# Altium schematic sheet F_BRIDGE.SchDoc
size A4; SheetNumber: 5; SheetTotal: 13
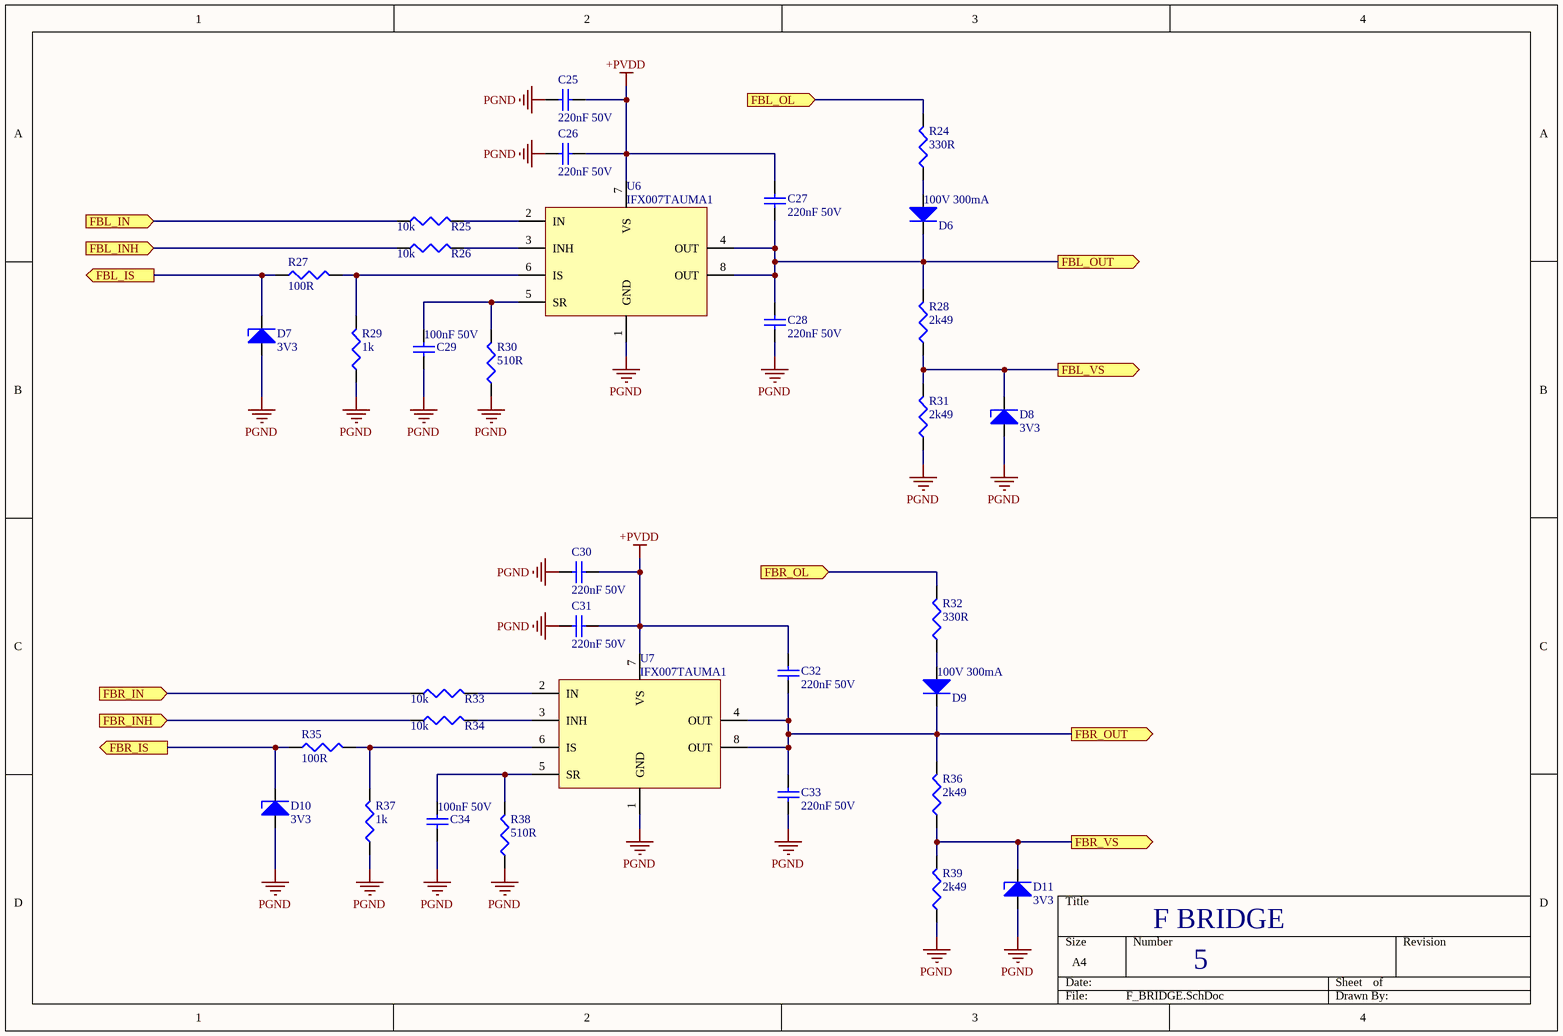
[diagram p0: F_BRIDGE.SchDoc]

## Parts
C25  220nF 50V  [CAP1206]
C26  220nF 50V  [CAP1206]
C27  220nF 50V  [CAP1206]
C28  220nF 50V  [CAP1206]
C29  100nF 50V  [CAP0603]
C30  220nF 50V  [CAP1206]
C31  220nF 50V  [CAP1206]
C32  220nF 50V  [CAP1206]
C33  220nF 50V  [CAP1206]
C34  100nF 50V  [CAP0603]
D6  100V 300mA  [SOD123_1N4148W-7-F]
D7  3V3  [SOD323]
D8  3V3  [SOD323]
D9  100V 300mA  [SOD123_1N4148W-7-F]
D10  3V3  [SOD323]
D11  3V3  [SOD323]
R24  330R  [RES0603]
R25  10k  [RES0603]
R26  10k  [RES0603]
R27  100R  [RES0603]
R28  2k49  [RES0603]
R29  1k  [RES0603]
R30  510R  [RES0603]
R31  2k49  [RES0603]
R32  330R  [RES0603]
R33  10k  [RES0603]
R34  10k  [RES0603]
R35  100R  [RES0603]
R36  2k49  [RES0603]
R37  1k  [RES0603]
R38  510R  [RES0603]
R39  2k49  [RES0603]
U6  P/N: IFX007TAUMA1  [TO-263-8]  (hidden comment: 55A)
U7  P/N: IFX007TAUMA1  [TO-263-8]  (hidden comment: 55A)

## Ports
FBL_IN (in), FBL_INH (in), FBL_IS (out), FBL_OL (in), FBL_OUT (out), FBL_VS (out), FBR_IN (in), FBR_INH (in), FBR_IS (out), FBR_OL (in), FBR_OUT (out), FBR_VS (out)

## Nets
+PVDD: C25.2 C26.2 C27.1 C30.2 C31.2 C32.1 U6.7(VS) U7.7(VS)
PGND: C25.1 C26.1 C28.2 C29.1 C30.1 C31.1 C33.2 C34.1 D7.2(A) D8.2(A) D10.2(A) D11.2(A) R29.1 R30.1 R31.1 R37.1 R38.1 R39.1 U6.1(GND) U7.1(GND)
FBL_IN: R25.1 ; port FBL_IN
FBL_INH: R26.1 ; port FBL_INH
FBL_IS: D7.1(K) R27.1 ; port FBL_IS
FBL_OL: R24.2 ; port FBL_OL
FBL_OUT: C27.2 C28.1 D6.2(K) R28.2 U6.4(OUT) U6.8(OUT) ; port FBL_OUT
FBL_VS: D8.1(K) R28.1 R31.2 ; port FBL_VS
FBR_IN: R33.1 ; port FBR_IN
FBR_INH: R34.1 ; port FBR_INH
FBR_IS: D10.1(K) R35.1 ; port FBR_IS
FBR_OL: R32.2 ; port FBR_OL
FBR_OUT: C32.2 C33.1 D9.2(K) R36.2 U7.4(OUT) U7.8(OUT) ; port FBR_OUT
FBR_VS: D11.1(K) R36.1 R39.2 ; port FBR_VS
NetC29_2: C29.2 R30.2 U6.5(SR)
NetC34_2: C34.2 R38.2 U7.5(SR)
NetD6_1: D6.1(A) R24.1
NetD9_1: D9.1(A) R32.1
NetR25_2: R25.2 U6.2(IN)
NetR26_2: R26.2 U6.3(INH)
NetR27_2: R27.2 R29.2 U6.6(IS)
NetR33_2: R33.2 U7.2(IN)
NetR34_2: R34.2 U7.3(INH)
NetR35_2: R35.2 R37.2 U7.6(IS)

## Notes on the sheet
- F BRIDGE

## Library data of the parts
C25-C28 C30-C33 = CAP1206_220nF: CAP CER 0.22UF 50V X7R 1206; P/N: CL31B224KBFNNNE; Order Code: DIGI : CL31B224KBFNNNE; Value: 220nF
C29 C34 = CAP0603_100nF: CAP CER 0.1UF 50V X7R 0603; P/N: C0603C104K5RACTU; Order Code: DIGI : 399-5089-1-ND; Value: 100nF 50V
D6 D9 = DIODE_1N4148W-7-F: DIODE GEN PURP 100V 300MA SOD123; Order Code: DIGI : 1N4148W-FDICT-ND; P/N: 1N4148W-7-F; Value: 100V 300mA
D7 D8 D10 D11 = ZENER_3V3_MM3Z3V3T1G: DIODE ZENER 3.3V 300MW SOD323; Order Code: DIGI : MM3Z3V3T1GOSCT-ND; P/N: MM3Z3V3T1G; Value: 3V3
R24 R32 = RES0603_330R: RES 330 OHM 1% 1/10W 0603; Order Code: DIGI : RMCF0603FT330RCT-ND; P/N: RMCF0603FT330R; ART Code: ART0021648; Value: 330R
R25 R26 R33 R34 = RES0603_10k: RES SMD 10K OHM 5% 1/10W 0603; Order Code: DIGI : 311-10KGRCT-ND; P/N: RC0603JR-0710KL; ART Code: ART0020747; Value: 10k
R27 R35 = RES0603_100R: RES SMD 100R OHM 1% 1/10W 0603; Order Code: DIGI : RMCF0603FT100RCT-ND; P/N: RMCF0603FT100R; ART Code: ART0022201; Value: 100R
R28 R31 R36 R39 = RES0603_2k49: RES 2.49K OHM 1% 1/10W 0603; Order Code: DIGI : RMCF0603FT2K49CT-ND; P/N: RMCF0603FT2K49; ART Code: ART0014241; Value: 2k49
R29 R37 = RES0603_1k: RES SMD 1K OHM 1% 1/10W 0603; Order Code: DIGI : 311-1.00KHRCT-ND; P/N: RC0603FR-071KL; ART Code: ART0014240; Value: 1k
R30 R38 = RES0603_510R: RES 510R OHM 1% 1/10W 0603; Order Code: DIGI : RMCF0603FT510RCT-ND; P/N: RMCF0603FT510R; Value: 510R
U6 U7 = HB_IFX007TAUMA1: IC HALF-BRIDGE DRVR 2 CH TO263; Order Code: DIGI : IFX007TAUMA1CT-ND; Value: 55A